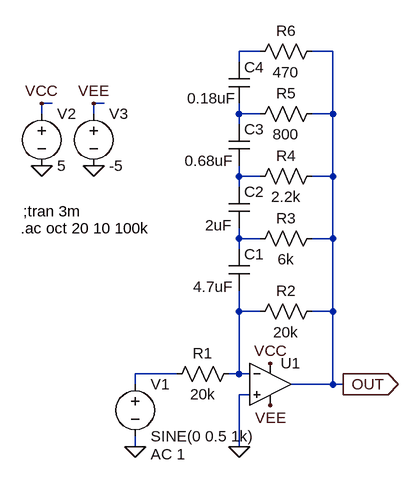
[diagram p0: schematic pink_noise1.asc]
pink_noise1.asc, the LTspice schematic file:
Version 4
SHEET 1 880 680
WIRE 224 -448 192 -448
WIRE 336 -448 304 -448
WIRE 192 -432 192 -448
WIRE -96 -368 -112 -368
WIRE -16 -368 -32 -368
WIRE -112 -352 -112 -368
WIRE -32 -352 -32 -368
WIRE 192 -352 192 -368
WIRE 224 -352 192 -352
WIRE 336 -352 336 -448
WIRE 336 -352 304 -352
WIRE 192 -336 192 -352
WIRE 192 -256 192 -272
WIRE 224 -256 192 -256
WIRE 336 -256 336 -352
WIRE 336 -256 304 -256
WIRE 192 -240 192 -256
WIRE 192 -160 192 -176
WIRE 224 -160 192 -160
WIRE 336 -160 336 -256
WIRE 336 -160 304 -160
WIRE 192 -144 192 -160
WIRE 192 -48 192 -80
WIRE 224 -48 192 -48
WIRE 336 -48 336 -160
WIRE 336 -48 304 -48
WIRE 96 48 32 48
WIRE 192 48 192 -48
WIRE 192 48 176 48
WIRE 208 48 192 48
WIRE 32 64 32 48
WIRE 336 64 336 -48
WIRE 336 64 272 64
WIRE 352 64 336 64
WIRE 208 80 192 80
WIRE 32 160 32 144
WIRE 192 160 192 80
FLAG 32 160 0
FLAG 240 32 VCC
FLAG 240 96 VEE
FLAG 192 160 0
FLAG 352 64 OUT
IOPIN 352 64 Out
FLAG -112 -272 0
FLAG -32 -272 0
FLAG -112 -368 VCC
FLAG -32 -368 VEE
SYMBOL voltage 32 48 R0
WINDOW 123 24 124 Left 2
WINDOW 39 0 0 Left 2
SYMATTR InstName V1
SYMATTR Value SINE(0 0.5 1k)
SYMATTR Value2 AC 1
SYMBOL Opamps\\UniversalOpamp2 240 64 R0
SYMATTR InstName U1
SYMBOL res 192 32 R90
WINDOW 0 0 56 VBottom 2
WINDOW 3 32 56 VTop 2
SYMATTR InstName R1
SYMATTR Value 20k
SYMBOL res 320 -64 R90
WINDOW 0 0 56 VBottom 2
WINDOW 3 32 56 VTop 2
SYMATTR InstName R2
SYMATTR Value 20k
SYMBOL cap 176 -144 R0
WINDOW 3 -55 58 Left 2
SYMATTR InstName C1
SYMATTR Value 4.7uF
SYMBOL cap 176 -240 R0
WINDOW 3 -36 59 Left 2
SYMATTR InstName C2
SYMATTR Value 2uF
SYMBOL cap 176 -336 R0
WINDOW 3 -68 56 Left 2
SYMATTR InstName C3
SYMATTR Value 0.68uF
SYMBOL cap 176 -432 R0
WINDOW 3 -64 56 Left 2
SYMATTR InstName C4
SYMATTR Value 0.18uF
SYMBOL res 320 -176 R90
WINDOW 0 0 56 VBottom 2
WINDOW 3 32 56 VTop 2
SYMATTR InstName R3
SYMATTR Value 6k
SYMBOL res 320 -272 R90
WINDOW 0 0 56 VBottom 2
WINDOW 3 32 56 VTop 2
SYMATTR InstName R4
SYMATTR Value 2.2k
SYMBOL res 320 -368 R90
WINDOW 0 0 56 VBottom 2
WINDOW 3 32 56 VTop 2
SYMATTR InstName R5
SYMATTR Value 800
SYMBOL res 320 -464 R90
WINDOW 0 0 56 VBottom 2
WINDOW 3 32 56 VTop 2
SYMATTR InstName R6
SYMATTR Value 470
SYMBOL voltage -112 -368 R0
WINDOW 123 0 0 Left 2
WINDOW 39 0 0 Left 2
SYMATTR InstName V2
SYMATTR Value 5
SYMBOL voltage -32 -368 R0
WINDOW 123 0 0 Left 2
WINDOW 39 0 0 Left 2
SYMATTR InstName V3
SYMATTR Value -5
TEXT -140 -202 Left 2 !;tran 3m
TEXT -144 -176 Left 2 !.ac oct 20 10 100k

The netlist it stands for:
* pink_noise1.asc
V1 N006 0 SINE(0 0.5 1k) AC 1
XU1 0 N005 VCC VEE OUT level.2 Avol=1Meg GBW=10Meg Slew=10Meg ilimit=25m rail=0 Vos=0 phimargin=45 en=0 enk=0 in=0 ink=0 Rin=500Meg  ; pins IN+ IN- V+ V- OUT
R1 N005 N006 20k
R2 OUT N005 20k
C1 N004 N005 4.7uF
C2 N003 N004 2uF
C3 N002 N003 0.68uF
C4 N001 N002 0.18uF
R3 OUT N004 6k
R4 OUT N003 2.2k
R5 OUT N002 800
R6 OUT N001 470
V2 VCC 0 5
V3 VEE 0 -5
;tran 3m
.ac oct 20 10 100k
.lib UniversalOpamps2.sub
.backanno
.end